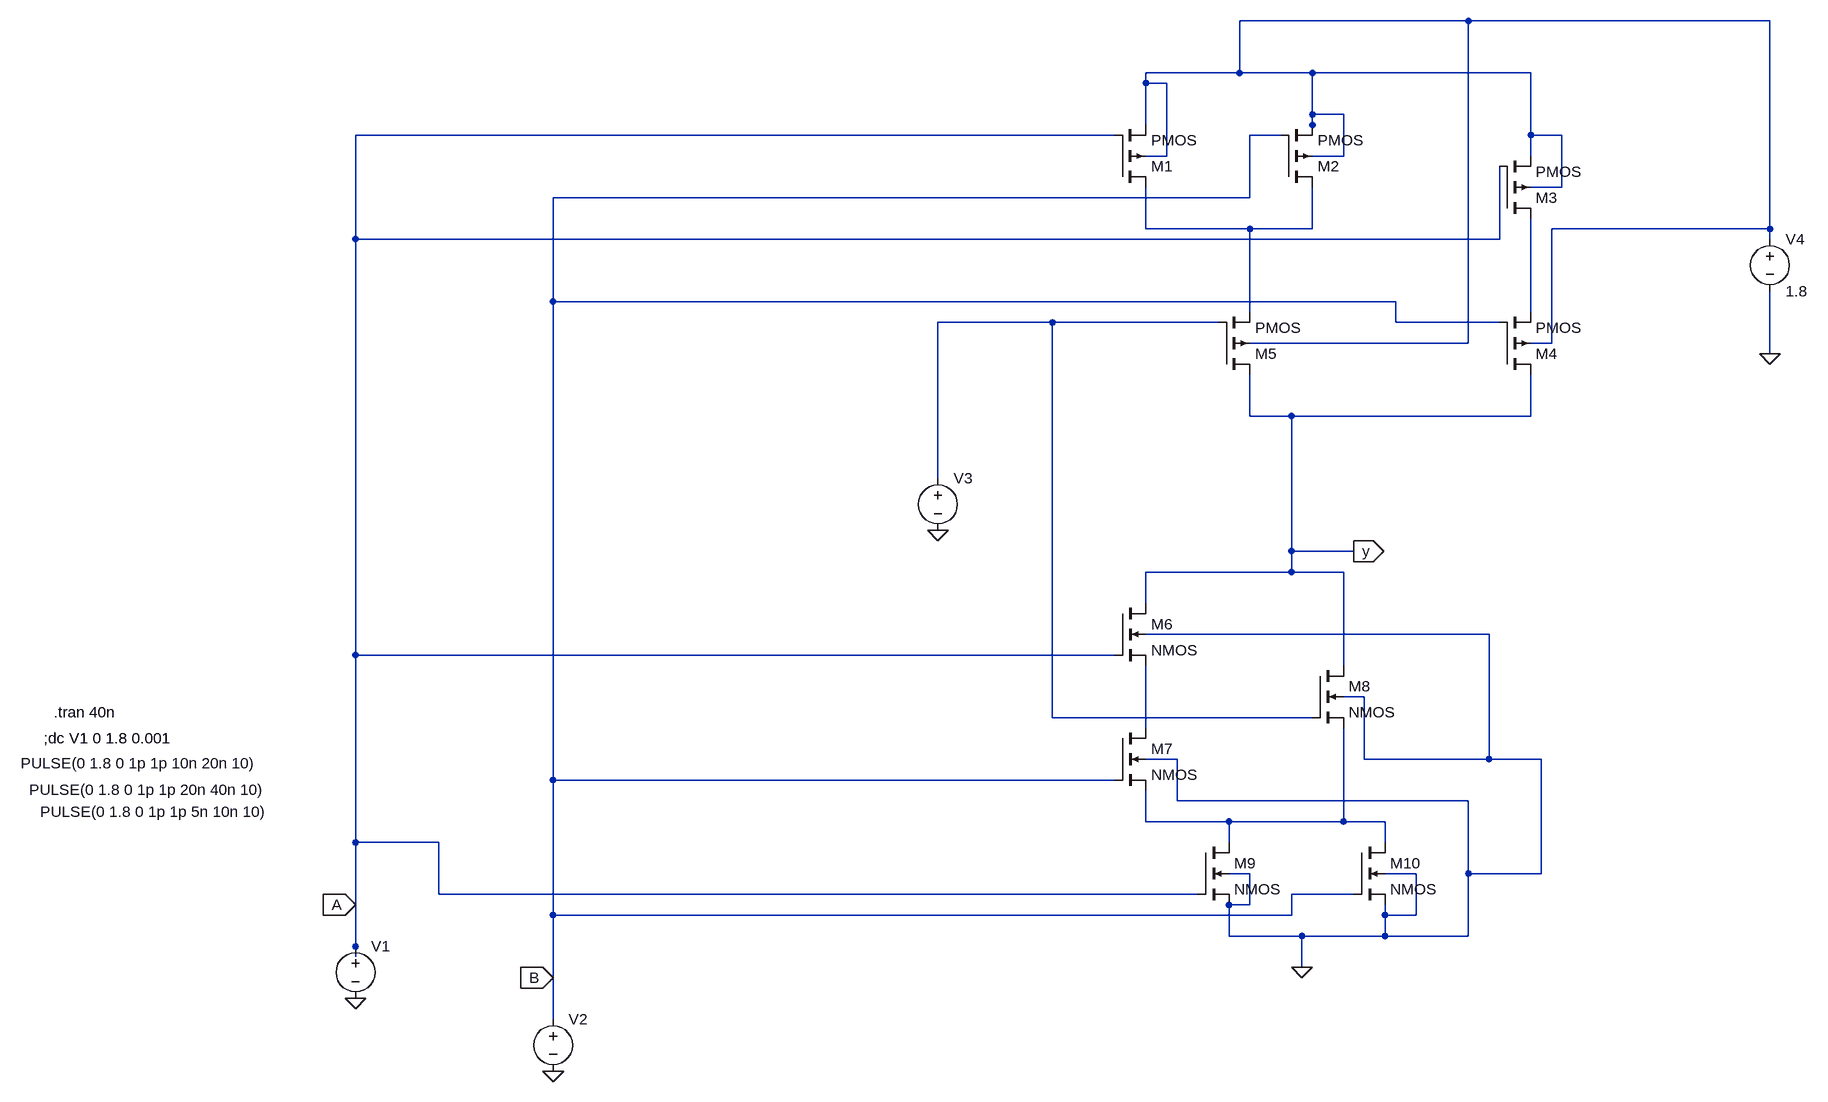
[diagram p0: schematic task1(Boolean_exp).asc]
task1(Boolean_exp).asc, the LTspice schematic file:
Version 4
SHEET 1 992 1264
WIRE 464 -464 112 -464
WIRE 928 -464 464 -464
WIRE 112 -384 112 -464
WIRE 112 -384 -32 -384
WIRE 224 -384 112 -384
WIRE 560 -384 224 -384
WIRE -32 -368 -32 -384
WIRE 0 -368 -32 -368
WIRE 224 -320 224 -384
WIRE 272 -320 224 -320
WIRE -32 -304 -32 -368
WIRE 224 -304 224 -320
WIRE -80 -288 -1248 -288
WIRE 176 -288 128 -288
WIRE 224 -288 224 -304
WIRE 560 -288 560 -384
WIRE 608 -288 560 -288
WIRE 0 -256 0 -368
WIRE 0 -256 -32 -256
WIRE 272 -256 272 -320
WIRE 272 -256 224 -256
WIRE 560 -256 560 -288
WIRE 608 -208 608 -288
WIRE 608 -208 560 -208
WIRE 128 -192 128 -288
WIRE 128 -192 -944 -192
WIRE -32 -144 -32 -208
WIRE 128 -144 -32 -144
WIRE 224 -144 224 -208
WIRE 224 -144 128 -144
WIRE 928 -144 928 -464
WIRE 928 -144 592 -144
WIRE -1248 -128 -1248 -288
WIRE 512 -128 512 -240
WIRE 512 -128 -1248 -128
WIRE 928 -128 928 -144
WIRE -944 -32 -944 -192
WIRE 352 -32 -944 -32
WIRE 128 -16 128 -144
WIRE 560 -16 560 -160
WIRE -176 0 -352 0
WIRE 80 0 -176 0
WIRE 352 0 352 -32
WIRE 512 0 352 0
WIRE 464 32 464 -464
WIRE 464 32 128 32
WIRE 592 32 592 -144
WIRE 592 32 560 32
WIRE 928 48 928 -48
WIRE 128 144 128 80
WIRE 192 144 128 144
WIRE 560 144 560 80
WIRE 560 144 192 144
WIRE -352 240 -352 0
WIRE 192 352 192 144
WIRE 288 352 192 352
WIRE 192 384 192 352
WIRE 192 384 -32 384
WIRE 272 384 192 384
WIRE -32 432 -32 384
WIRE 496 480 -32 480
WIRE -1248 512 -1248 -128
WIRE -80 512 -1248 512
WIRE 272 528 272 384
WIRE 304 576 272 576
WIRE -176 608 -176 0
WIRE 224 608 -176 608
WIRE -32 624 -32 528
WIRE 16 672 -32 672
WIRE 304 672 304 576
WIRE 496 672 496 480
WIRE 496 672 304 672
WIRE 576 672 496 672
WIRE -944 704 -944 -32
WIRE -80 704 -944 704
WIRE 16 736 16 672
WIRE 464 736 16 736
WIRE -32 768 -32 720
WIRE 96 768 -32 768
WIRE 272 768 272 624
WIRE 272 768 96 768
WIRE 336 768 272 768
WIRE -1248 800 -1248 512
WIRE -1120 800 -1248 800
WIRE 96 800 96 768
WIRE 336 800 336 768
WIRE 128 848 96 848
WIRE 384 848 336 848
WIRE 464 848 464 736
WIRE 576 848 576 672
WIRE 576 848 464 848
WIRE -1120 880 -1120 800
WIRE 48 880 -1120 880
WIRE 288 880 192 880
WIRE -1248 896 -1248 800
WIRE 128 896 128 848
WIRE 128 896 96 896
WIRE -944 912 -944 704
WIRE 192 912 192 880
WIRE 192 912 -944 912
WIRE 336 912 336 896
WIRE 384 912 384 848
WIRE 384 912 336 912
WIRE 96 944 96 896
WIRE 208 944 96 944
WIRE 336 944 336 912
WIRE 336 944 208 944
WIRE 464 944 464 848
WIRE 464 944 336 944
WIRE -1248 960 -1248 896
WIRE -1248 976 -1248 960
WIRE 208 992 208 944
WIRE -944 1008 -944 912
WIRE -944 1072 -944 1008
FLAG 208 992 0
FLAG 928 48 0
FLAG -1248 1040 0
FLAG -944 1152 0
FLAG -352 320 0
FLAG -1248 896 A
IOPIN -1248 896 In
FLAG -944 1008 B
IOPIN -944 1008 In
FLAG 288 352 y
IOPIN 288 352 Out
SYMBOL nmos4 -80 432 R0
SYMATTR InstName M6
SYMATTR Value2 l=180n w=1500n
SYMBOL nmos4 -80 624 R0
SYMATTR InstName M7
SYMATTR Value2 l=180n w=1500n
SYMBOL nmos4 224 528 R0
SYMATTR InstName M8
SYMATTR Value2 l=180n w=1000n
SYMBOL nmos4 48 800 R0
SYMATTR InstName M9
SYMATTR Value2 l=180n w=1500n
SYMBOL nmos4 288 800 R0
SYMATTR InstName M10
SYMATTR Value2 l=180n w=1000n
SYMBOL voltage 928 -144 R0
WINDOW 123 0 0 Left 0
WINDOW 39 0 0 Left 0
SYMATTR InstName V4
SYMATTR Value 1.8
SYMBOL voltage -1248 944 R0
WINDOW 3 -502 -225 Left 2
WINDOW 123 0 0 Left 0
WINDOW 39 0 0 Left 0
SYMATTR Value PULSE(0 1.8 0 1p 1p 20n 40n 10)
SYMATTR InstName V1
SYMBOL voltage -944 1056 R0
WINDOW 3 -819 -378 Left 2
WINDOW 123 0 0 Left 0
WINDOW 39 0 0 Left 0
SYMATTR Value PULSE(0 1.8 0 1p 1p 10n 20n 10)
SYMATTR InstName V2
SYMBOL voltage -352 224 R0
WINDOW 3 -1381 529 Left 2
WINDOW 123 0 0 Left 0
WINDOW 39 0 0 Left 0
SYMATTR Value PULSE(0 1.8 0 1p 1p 5n 10n 10)
SYMATTR InstName V3
SYMBOL pmos4 -80 -208 M180
SYMATTR InstName M1
SYMATTR Value2 l=180n w=3400n
SYMBOL pmos4 176 -208 M180
SYMATTR InstName M2
SYMATTR Value2 l=180n w=3400n
SYMBOL pmos4 512 -160 M180
SYMATTR InstName M3
SYMATTR Value2 l=180n w=3400n
SYMBOL pmos4 512 80 M180
SYMATTR InstName M4
SYMATTR Value2 l=180n w=3400n
SYMBOL pmos4 80 80 M180
SYMATTR InstName M5
SYMATTR Value2 l=180n w=3400n
TEXT -1728 640 Left 2 !;dc V1 0 1.8 0.001
TEXT -1712 600 Left 2 !.tran 40n

The netlist it stands for:
* task1(Boolean_exp).asc
M6 y A N005 0 NMOS l=180n w=1500n
M7 N005 B N006 0 NMOS l=180n w=1500n
M8 y N004 N006 0 NMOS l=180n w=1000n
M9 N006 A 0 0 NMOS l=180n w=1500n
M10 N006 B 0 0 NMOS l=180n w=1000n
V4 N001 0 1.8
V1 A 0 PULSE(0 1.8 0 1p 1p 20n 40n 10)
V2 B 0 PULSE(0 1.8 0 1p 1p 10n 20n 10)
V3 N004 0 PULSE(0 1.8 0 1p 1p 5n 10n 10)
M1 N002 A N001 N001 PMOS l=180n w=3400n
M2 N002 B N001 N001 PMOS l=180n w=3400n
M3 N003 A N001 N001 PMOS l=180n w=3400n
M4 y B N003 N001 PMOS l=180n w=3400n
M5 y N004 N002 N001 PMOS l=180n w=3400n
.model NMOS NMOS
.model PMOS PMOS
.lib standard.mos
;dc V1 0 1.8 0.001
.tran 40n
.backanno
.end